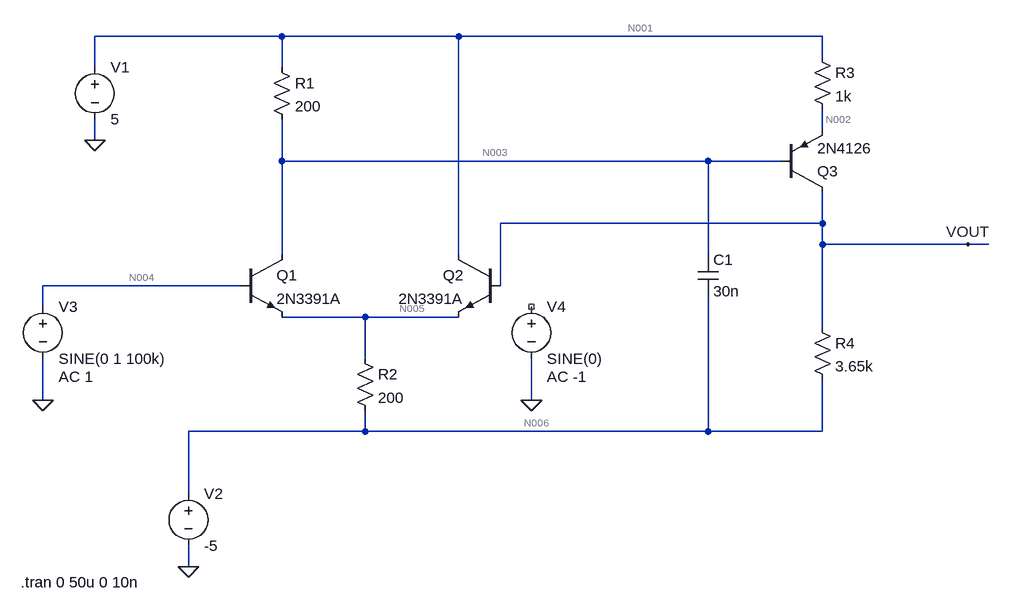
[diagram p0: schematic bipolar_buffer001.asc]
bipolar_buffer001.asc, the LTspice schematic file:
Version 4
SHEET 1 1252 728
WIRE 144 -128 -144 -128
WIRE 416 -128 144 -128
WIRE 976 -128 416 -128
WIRE 976 -96 976 -128
WIRE -144 -80 -144 -128
WIRE 144 -80 144 -128
WIRE 976 16 976 -16
WIRE -144 32 -144 0
WIRE 144 64 144 0
WIRE 800 64 144 64
WIRE 912 64 800 64
WIRE 976 160 976 112
WIRE 976 160 480 160
WIRE 976 192 976 160
WIRE 1200 192 976 192
WIRE 1232 192 1200 192
WIRE 144 208 144 64
WIRE 416 208 416 -128
WIRE 800 208 800 64
WIRE 80 256 -224 256
WIRE 480 256 480 160
WIRE -224 288 -224 256
WIRE 272 304 144 304
WIRE 416 304 272 304
WIRE 976 320 976 192
WIRE 272 368 272 304
WIRE -224 432 -224 368
WIRE 528 432 528 368
WIRE 272 480 272 448
WIRE 272 480 0 480
WIRE 800 480 800 272
WIRE 800 480 272 480
WIRE 976 480 976 400
WIRE 976 480 800 480
WIRE 0 576 0 480
WIRE 0 688 0 656
FLAG -144 32 0
FLAG 0 688 0
FLAG 1200 192 VOUT
FLAG -224 432 0
FLAG 528 432 0
SYMBOL voltage -144 -96 R0
WINDOW 123 0 0 Left 0
WINDOW 39 0 0 Left 0
SYMATTR InstName V1
SYMATTR Value 5
SYMBOL res 128 -96 R0
SYMATTR InstName R1
SYMATTR Value 200
SYMBOL npn 80 208 R0
SYMATTR InstName Q1
SYMATTR Value 2N3391A
SYMBOL npn 480 208 M0
SYMATTR InstName Q2
SYMATTR Value 2N3391A
SYMBOL res 256 352 R0
SYMATTR InstName R2
SYMATTR Value 200
SYMBOL voltage 0 560 R0
WINDOW 123 0 0 Left 0
WINDOW 39 0 0 Left 0
SYMATTR InstName V2
SYMATTR Value -5
SYMBOL pnp 912 112 M180
SYMATTR InstName Q3
SYMATTR Value 2N4126
SYMBOL res 960 -112 R0
SYMATTR InstName R3
SYMATTR Value 1k
SYMBOL res 960 304 R0
SYMATTR InstName R4
SYMATTR Value 3.65k
SYMBOL voltage -224 272 R0
WINDOW 123 24 124 Left 2
WINDOW 39 0 0 Left 0
SYMATTR Value2 AC 1
SYMATTR InstName V3
SYMATTR Value SINE(0 1 100k)
SYMBOL voltage 528 272 R0
WINDOW 123 24 124 Left 2
WINDOW 39 0 0 Left 0
SYMATTR Value2 AC -1
SYMATTR InstName V4
SYMATTR Value SINE(0)
SYMBOL cap 784 208 R0
SYMATTR InstName C1
SYMATTR Value 30n
TEXT -258 712 Left 2 !.tran 0 50u 0 10n

The netlist it stands for:
* bipolar_buffer001.asc
V1 N001 0 5
R1 N001 N003 200
Q1 N003 N004 N005 0 2N3391A
Q2 N001 VOUT N005 0 2N3391A
R2 N005 N006 200
V2 N006 0 -5
Q3 VOUT N003 N002 0 2N4126
R3 N001 N002 1k
R4 VOUT N006 3.65k
V3 N004 0 SINE(0 1 100k) AC 1
V4 NC_01 0 SINE(0) AC -1
C1 N003 N006 30n
.model NPN NPN
.model PNP PNP
.lib standard.bjt
.tran 0 50u 0 10n
.backanno
.end

* Results of the author's LTspice run, read from the files saved beside the schematic
* Operating Point, zero values left out:
*   V(n001) = 5 V
*   V(n003) = 2.886 V
*   V(n005) = -712 mV
*   V(vout) = -847.8 µV
*   V(n006) = -5 V
*   V(n002) = 3.597 V
*   Ic(Q3) = -1.397 mA
*   Ib(Q3) = -6.033 µA
*   Ie(Q3) = 1.403 mA
*   Ic(Q2) = 10.81 mA
*   Ib(Q2) = 27.62 µA
*   Ie(Q2) = -10.83 mA
*   Ic(Q1) = 10.58 mA
*   Ib(Q1) = 28.48 µA
*   Ie(Q1) = -10.61 mA
*   I(R4) = 1.37 mA
*   I(R3) = 1.403 mA
*   I(R2) = 21.44 mA
*   I(R1) = 10.57 mA
*   I(V3) = -28.48 µA
*   I(V2) = 22.81 mA
*   I(V1) = -22.78 mA
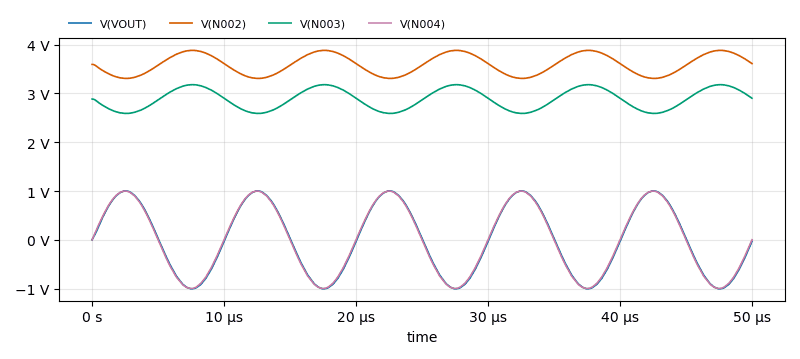
[diagram p1: Transient Analysis of bipolar_buffer001.asc, plotted from the saved traces]
* Transient Analysis, 1 run:
*   V(VOUT): min -1.005 V, max 1.002 V, average -495 µV, rms 709.9 mV, last -33.03 mV
*   V(N002): min 3.309 V, max 3.884 V, average 3.596 V, rms 3.602 V, last 3.614 V
*   V(N003): min 2.591 V, max 3.18 V, average 2.885 V, rms 2.893 V, last 2.903 V
*   V(N004): min -999.6 mV, max 1 V, average 739 µV, rms 707 mV, last 0 V